# EAGLE schematic trigsources (EAGLE 9.2.0)
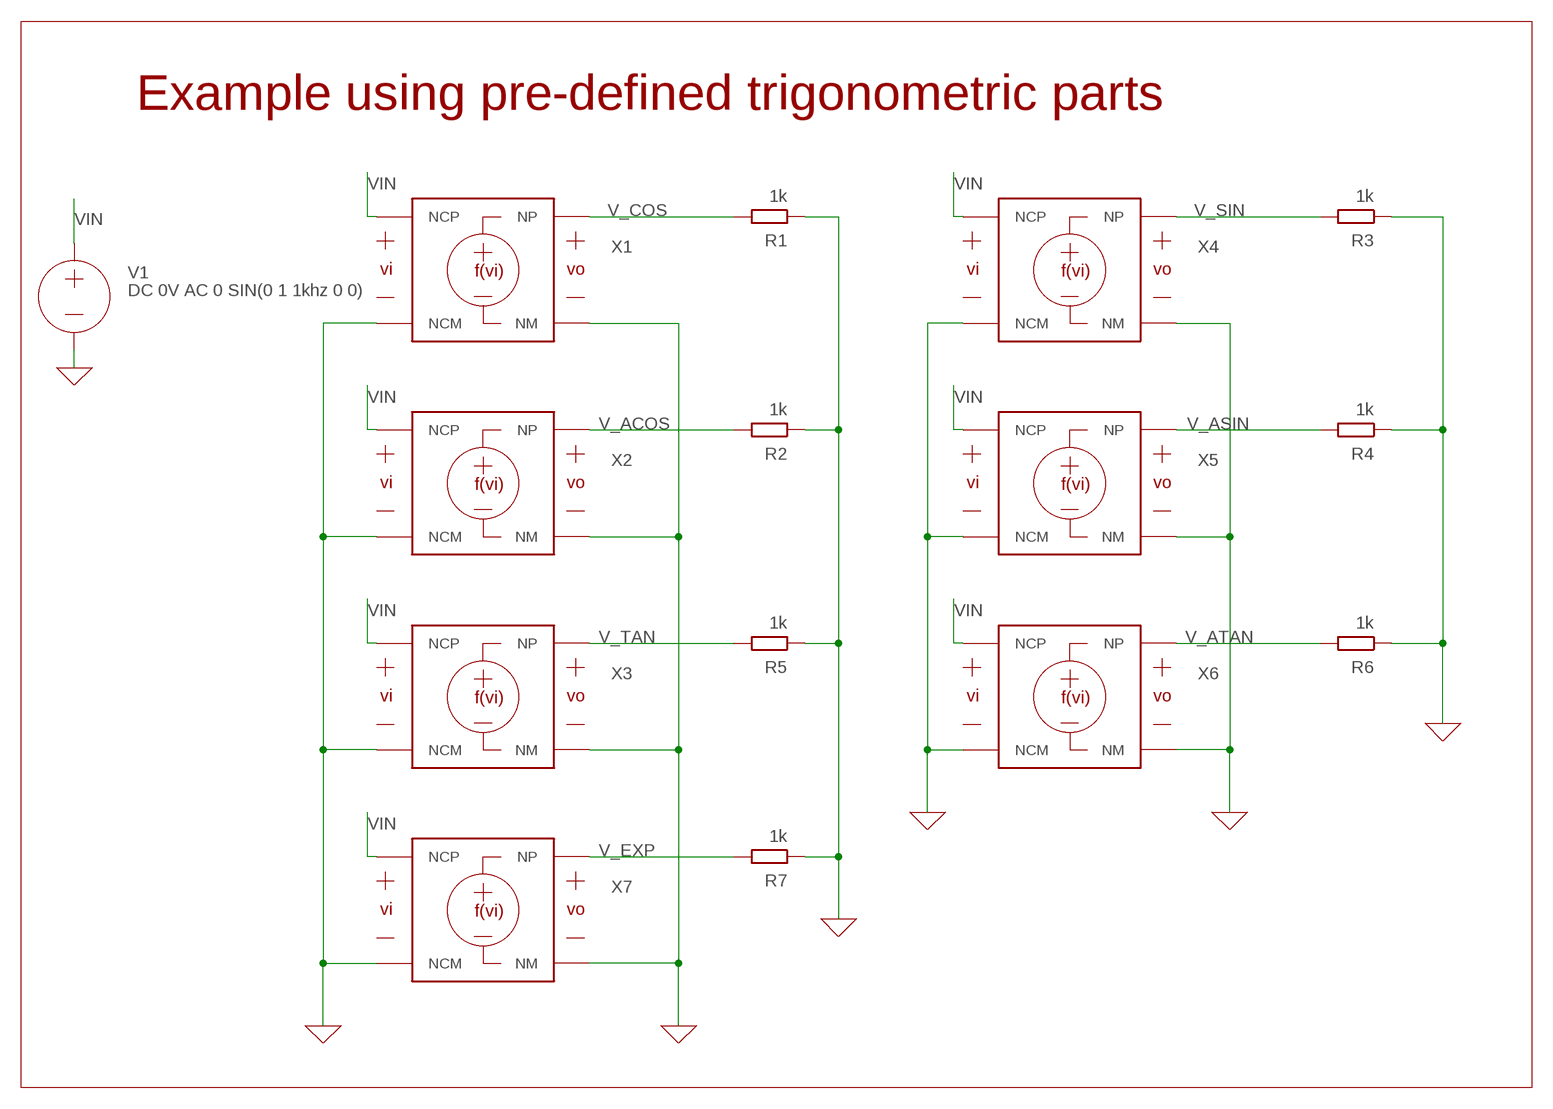
[diagram p0: schematic, sheet 1]

## Parts
R1  1k  R  (no package)
R2  1k  R  (no package)
R3  1k  R  (no package)
R4  1k  R  (no package)
R5  1k  R  (no package)
R6  1k  R  (no package)
R7  1k  R  (no package)
V1  DC 0V AC 0 SIN(0 1 1khz 0 0)  VOLTAGE  (no package)
X1  FN_COS  (no package)
X2  FN_ACOS  (no package)
X3  FN_TAN  (no package)
X4  FN_SIN  (no package)
X5  FN_ASIN  (no package)
X6  FN_ATAN  (no package)
X7  FN_EXP  (no package)

## Nets
0: R1.1 R2.1 R3.1 R4.1 R5.1 R6.1 R7.1 V1.- X1.NCM X1.NM X2.NCM X2.NM X3.NCM X3.NM X4.NCM X4.NM X5.NCM X5.NM X6.NCM X6.NM X7.NCM X7.NM ; supply symbol labelled GND
V_ACOS: R2.2 X2.NP
V_ASIN: R4.2 X5.NP
V_ATAN: R6.2 X6.NP
V_COS: R1.2 X1.NP
V_EXP: R7.2 X7.NP
V_SIN: R3.2 X4.NP
V_TAN: R5.2 X3.NP
VIN: V1.+ X1.NCP X2.NCP X3.NCP X4.NCP X5.NCP X6.NCP X7.NCP

## Notes on the sheet
- Example using pre-defined trigonometric parts

## Library data of the parts
R1-R7 = ngspice-simulation:R: RESISTOR
V1 = ngspice-simulation:VOLTAGE: Independent Voltage Source, either DC, AC, PULSE, SINE, PWL, EXP, or SFFM; VALUE: 0V
X1 = ngspice-simulation:FN_COS: Voltage controlled source setup to use built-in function Bxx NP NM v=f(V(NCP,NCM))
X2 = ngspice-simulation:FN_ACOS: Voltage controlled source setup to use built-in function Bxx NP NM v=f(V(NCP,NCM))
X3 = ngspice-simulation:FN_TAN: Voltage controlled source setup to use built-in function Bxx NP NM v=f(V(NCP,NCM))
X4 = ngspice-simulation:FN_SIN: Voltage controlled source setup to use built-in function Bxx NP NM v=f(V(NCP,NCM))
X5 = ngspice-simulation:FN_ASIN: Voltage controlled source setup to use built-in function Bxx NP NM v=f(V(NCP,NCM))
X6 = ngspice-simulation:FN_ATAN: Voltage controlled source setup to use built-in function Bxx NP NM v=f(V(NCP,NCM))
X7 = ngspice-simulation:FN_EXP: Voltage controlled source setup to use built-in function Bxx NP NM v=f(V(NCP,NCM))